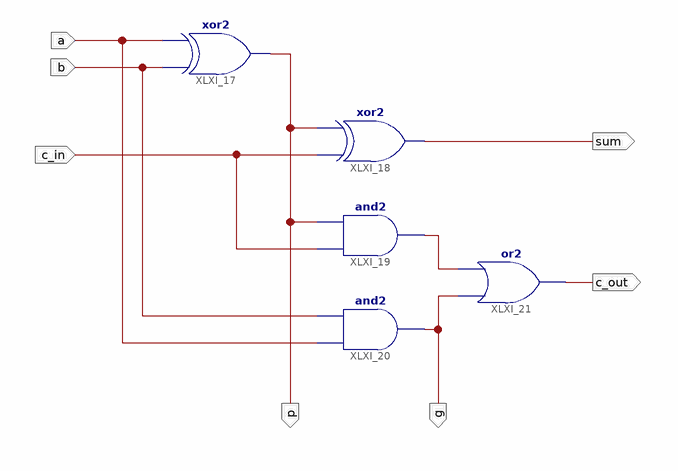
[diagram p0: schematic sheet 1]
// Xilinx ISE schematic full_adder.sch (spartan3e) as structural Verilog: 5 symbols, 7 ports
module full_adder (
  input  a,
  input  b,
  input  c_in,
  output p,
  output g,
  output sum,
  output c_out
);

  wire XLXN_144;

  xor XLXI_17 (p, b, a);
  xor XLXI_18 (sum, c_in, p);
  and XLXI_19 (XLXN_144, c_in, p);
  and XLXI_20 (g, a, b);
  or XLXI_21 (c_out, g, XLXN_144);
endmodule
